# Altium project MCP33151 Eval Board.PrjPcb (part 3 of 3)
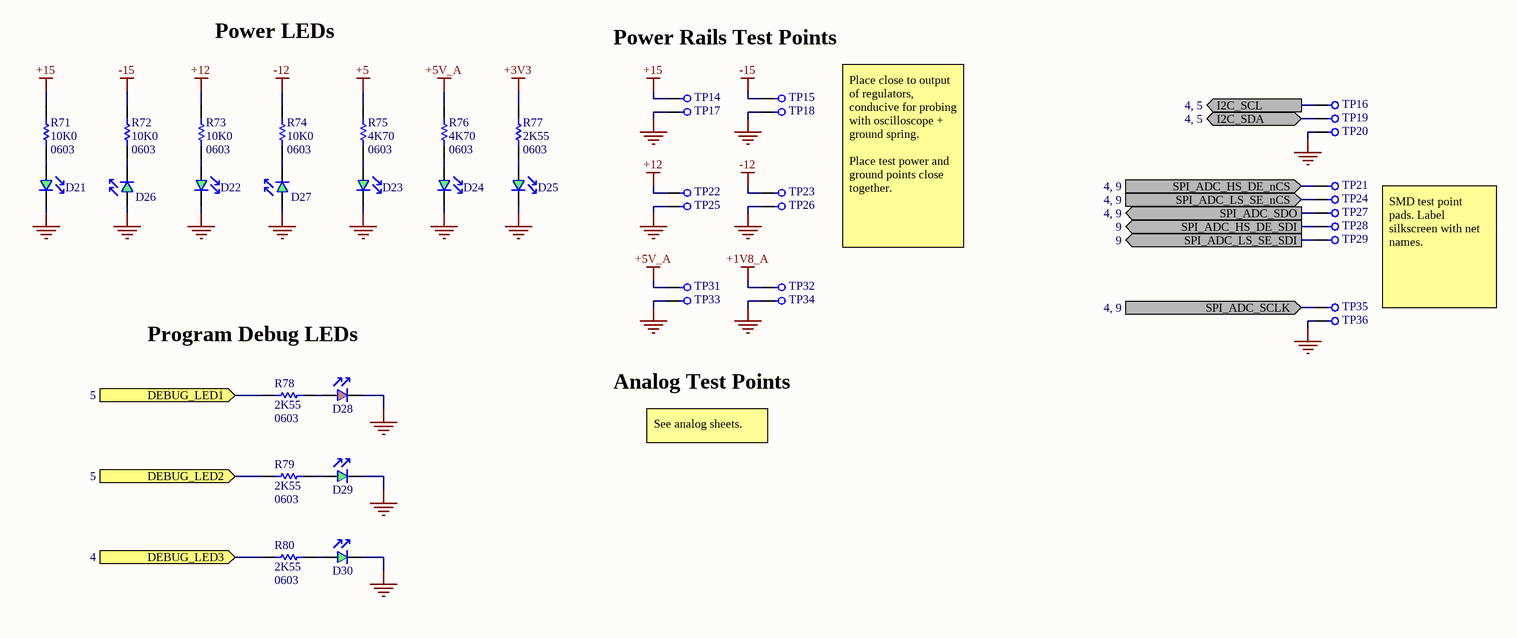
[diagram p11: Debug.SchDoc]

## Nets that join several sheets
+1V8_A: Power (C15.2 C16.2 U6.5), ADC (C66.2 C71.2 U24.2 U25.2), Debug (TP32.1)
+3V3: Connectors (P37.1), Power (C13.2 C14.2 U6.1 U6.3), Microcontroller (R30.1 R31.1 R81.1 U10.46), IO Expansion (7 pins), Digital IO Protection (16 pins), ADC (11 pins), Debug (R77.2)
+5: Connectors (P34.1), Power (7 pins), Microcontroller (U10.48), Analog - High Speed DE (R88.1), Analog - Low Speed SE (R90.1), Debug (R75.2)
+5V_A: Power (R28.2 R92.1 U7.1), Analog - High Speed DE (R87.1), Analog - Low Speed SE (R89.1), ADC (6 pins), Debug (R76.2 TP31.1)
+12: Connectors (P35.1), Power (5 pins), Analog - High Speed DE (14 pins), Analog - Low Speed SE (14 pins), Debug (R73.2 TP22.1)
+15: Power (5 pins), Debug (R71.2 TP14.1)
-12: Connectors (P36.1), Power (C27.2 U8.1), Analog - High Speed DE (12 pins), Analog - Low Speed SE (10 pins), Debug (R74.2 TP23.1)
-15: Power (8 pins), Debug (R72.2 TP15.1)
GND: Connectors (16 pins), Power (42 pins), Microcontroller (6 pins), IO Expansion (9 pins), Digital IO Protection (16 pins), Analog - High Speed DE (30 pins), Analog - Low Speed SE (32 pins), ADC (16 pins), Relay Drivers (8 pins), Debug (18 pins)
AIN_HS_DE_1_N: Connectors (P1.2), Analog - High Speed DE (U14.4)
AIN_HS_DE_1_P: Connectors (P1.1), Analog - High Speed DE (U14.13)
AIN_HS_DE_2_N: Connectors (P6.2), Analog - High Speed DE (U14.5)
AIN_HS_DE_2_P: Connectors (P6.1), Analog - High Speed DE (U14.12)
AIN_HS_DE_3_N: Connectors (P11.2), Analog - High Speed DE (U14.6)
AIN_HS_DE_3_P: Connectors (P11.1), Analog - High Speed DE (U14.11)
AIN_HS_DE_4_N: Connectors (P16.2), Analog - High Speed DE (U14.7)
AIN_HS_DE_4_P: Connectors (P16.1), Analog - High Speed DE (U14.10)
AIN_HS_DE_FILTERED: Analog - High Speed DE (C53.2 R56.1), ADC (U24.3)
AIN_LS_MUX_SELECT_A0: Microcontroller (U10.36), Analog - Low Speed SE (U20.1)
AIN_LS_MUX_SELECT_A1: Microcontroller (U10.30), Analog - Low Speed SE (U20.16)
AIN_LS_SE_1: Connectors (P2.2), Analog - Low Speed SE (U19.4)
AIN_LS_SE_2: Connectors (P2.1), Analog - Low Speed SE (U19.5)
AIN_LS_SE_3: Connectors (P7.2), Analog - Low Speed SE (U19.6)
AIN_LS_SE_4: Connectors (P7.1), Analog - Low Speed SE (U19.7)
AIN_LS_SE_5: Connectors (P12.2), Analog - Low Speed SE (U19.12)
AIN_LS_SE_6: Connectors (P12.1), Analog - Low Speed SE (U19.11)
AIN_LS_SE_7: Connectors (P17.2), Analog - Low Speed SE (U19.10)
AIN_LS_SE_8: Connectors (P17.1), Analog - Low Speed SE (U19.9)
AIN_LS_SE_9: Connectors (P23.2), Analog - Low Speed SE (U22.4)
AIN_LS_SE_10: Connectors (P23.1), Analog - Low Speed SE (U22.5)
AIN_LS_SE_11: Connectors (P26.2), Analog - Low Speed SE (U22.6)
AIN_LS_SE_12: Connectors (P26.1), Analog - Low Speed SE (U22.7)
AIN_LS_SE_13: Connectors (P28.2), Analog - Low Speed SE (U22.12)
AIN_LS_SE_14: Connectors (P28.1), Analog - Low Speed SE (U22.11)
AIN_LS_SE_15: Connectors (P29.2), Analog - Low Speed SE (U22.10)
AIN_LS_SE_16: Connectors (P29.1), Analog - Low Speed SE (U22.9)
AIN_LS_SE_FILTERED: Analog - Low Speed SE (C57.2 R61.1), ADC (U25.3)
AIN_MUX_1_LS_SE_A0: Microcontroller (U10.27), Analog - Low Speed SE (U19.1)
AIN_MUX_1_LS_SE_A1: Microcontroller (U10.28), Analog - Low Speed SE (U19.16)
AIN_MUX_1_LS_SE_A2: Microcontroller (U10.29), Analog - Low Speed SE (U19.15)
AIN_MUX_2_LS_SE_A0: Microcontroller (U10.31), Analog - Low Speed SE (U22.1)
AIN_MUX_2_LS_SE_A1: Microcontroller (U10.33), Analog - Low Speed SE (U22.16)
AIN_MUX_2_LS_SE_A2: Microcontroller (U10.32), Analog - Low Speed SE (U22.15)
AIN_MUX_HS_DE_A0: Microcontroller (R101.1), Analog - High Speed DE (U14.1)
AIN_MUX_HS_DE_A1: Microcontroller (R102.1), Analog - High Speed DE (U14.16)
DEBUG_LED1: IO Expansion (U11.9), Debug (R78.2)
DEBUG_LED2: IO Expansion (U11.10), Debug (R79.2)
DEBUG_LED3: Microcontroller (U10.24), Debug (R80.2)
DIO_1: Connectors (P4.2), Digital IO Protection (R1.1)
DIO_1_PROT: Microcontroller (U10.2), Digital IO Protection (R3.1)
DIO_2: Connectors (P4.1), Digital IO Protection (R5.1)
DIO_2_PROT: Microcontroller (U10.3), Digital IO Protection (R7.1)
DIO_3: Connectors (P9.2), Digital IO Protection (R9.1)
DIO_3_PROT: Microcontroller (U10.16), Digital IO Protection (R11.1)
DIO_4: Connectors (P9.1), Digital IO Protection (R13.1)
DIO_4_PROT: Microcontroller (U10.17), Digital IO Protection (R15.1)
DIO_5: Connectors (P14.2), Digital IO Protection (R17.1)
DIO_5_PROT: Microcontroller (U10.18), Digital IO Protection (R19.1)
DIO_6: Connectors (P14.1), Digital IO Protection (R2.1)
DIO_6_PROT: Microcontroller (U10.19), Digital IO Protection (R4.1)
DIO_7: Connectors (P19.2), Digital IO Protection (R6.1)
DIO_7_PROT: Microcontroller (U10.20), Digital IO Protection (R8.1)
DIO_8: Connectors (P19.1), Digital IO Protection (R10.1)
DIO_8_PROT: Microcontroller (U10.21), Digital IO Protection (R12.1)
DIO_9: Connectors (P25.2), Digital IO Protection (R14.1)
DIO_9_PROT: Microcontroller (U10.22), Digital IO Protection (R16.1)
DIO_10: Connectors (P25.1), Digital IO Protection (R18.1)
DIO_10_PROT: Microcontroller (U10.23), Digital IO Protection (R20.1)
HS_DE_GAIN_MUX_A0: Microcontroller (R104.1), Analog - High Speed DE (U18.1)
HS_DE_GAIN_MUX_A1: Microcontroller (R103.1), Analog - High Speed DE (U18.16)
I2C_SCL: Microcontroller (R30.2 U10.41), IO Expansion (U11.19 U12.19), Debug (TP16.1)
I2C_SDA: Microcontroller (R31.2 U10.40), IO Expansion (U11.20 U12.20), Debug (TP19.1)
INT: Microcontroller (U10.10), IO Expansion (R32.2 U12.7)
IO_EXPANSION_DIO1: Connectors (P5.2), Digital IO Protection (R33.1)
IO_EXPANSION_DIO1_PROT: IO Expansion (U12.9), Digital IO Protection (R35.1)
IO_EXPANSION_DIO2: Connectors (P5.1), Digital IO Protection (R37.1)
IO_EXPANSION_DIO2_PROT: IO Expansion (U12.10), Digital IO Protection (R38.1)
IO_EXPANSION_DIO3: Connectors (P10.2), Digital IO Protection (R39.1)
IO_EXPANSION_DIO3_PROT: IO Expansion (U12.11), Digital IO Protection (R40.1)
IO_EXPANSION_DIO4: Connectors (P10.1), Digital IO Protection (R41.1)
IO_EXPANSION_DIO4_PROT: IO Expansion (U12.12), Digital IO Protection (R42.1)
IO_EXPANSION_DIO5: Connectors (P15.2), Digital IO Protection (R43.1)
IO_EXPANSION_DIO5_PROT: IO Expansion (U12.13), Digital IO Protection (R44.1)
IO_EXPANSION_DIO6: Connectors (P15.1), Digital IO Protection (R34.1)
IO_EXPANSION_DIO6_PROT: IO Expansion (U12.14), Digital IO Protection (R36.1)
LS_SE_GAIN_MUX_A0: Microcontroller (U10.26), Analog - Low Speed SE (U23.1)
LS_SE_GAIN_MUX_A1: Microcontroller (U10.25), Analog - Low Speed SE (U23.16)
nRESET: Microcontroller (U10.9), IO Expansion (R91.2 U11.4 U12.4)
RELAY_COIL_PWR_IN_CH_1: Connectors (P3.2), Relay Drivers (U1.6)
RELAY_COIL_PWR_IN_CH_2: Connectors (P3.1), Relay Drivers (U1.3)
RELAY_COIL_PWR_IN_CH_3: Connectors (P8.2), Relay Drivers (U2.6)
RELAY_COIL_PWR_IN_CH_4: Connectors (P8.1), Relay Drivers (U2.3)
RELAY_COIL_PWR_IN_CH_5: Connectors (P13.2), Relay Drivers (U3.6)
RELAY_COIL_PWR_IN_CH_6: Connectors (P13.1), Relay Drivers (U3.3)
RELAY_COIL_PWR_IN_CH_7: Connectors (P18.2), Relay Drivers (U4.6)
RELAY_COIL_PWR_IN_CH_8: Connectors (P18.1), Relay Drivers (U4.3)
RELAY_DRIVER_EN_CH_1: IO Expansion (U11.11), Relay Drivers (U1.2)
RELAY_DRIVER_EN_CH_2: IO Expansion (U11.12), Relay Drivers (U1.5)
RELAY_DRIVER_EN_CH_3: IO Expansion (U11.13), Relay Drivers (U2.2)
RELAY_DRIVER_EN_CH_4: IO Expansion (U11.14), Relay Drivers (U2.5)
RELAY_DRIVER_EN_CH_5: IO Expansion (U11.15), Relay Drivers (U3.2)
RELAY_DRIVER_EN_CH_6: IO Expansion (U11.16), Relay Drivers (U3.5)
RELAY_DRIVER_EN_CH_7: IO Expansion (U12.15), Relay Drivers (U4.2)
RELAY_DRIVER_EN_CH_8: IO Expansion (U12.16), Relay Drivers (U4.5)
SDI_HS_DE: ADC (P32.1 R68.1 U24.9), Debug (TP28.1)
SDI_LS_SE: ADC (P33.1 R69.1 U25.9), Debug (TP29.1)
SPI_ADC_HS_DE_nCS: Microcontroller (R106.1), ADC (R66.1 U24.6), Debug (TP21.1)
SPI_ADC_LS_SE_nCS: Microcontroller (R105.1), ADC (R70.1 U25.6), Debug (TP24.1)
SPI_ADC_SCLK: Microcontroller (R29.2), ADC (U24.8 U25.8), Debug (TP35.1)
SPI_ADC_SDO: Microcontroller (U10.14), ADC (R67.1 U24.7 U25.7), Debug (TP27.1)

## Assembly variants
Default to test: not fitted C4 C6 C20 C35 C36 C39 C53 C57 C76 R32 R46 R48 R49 R67 R84 R88 R90